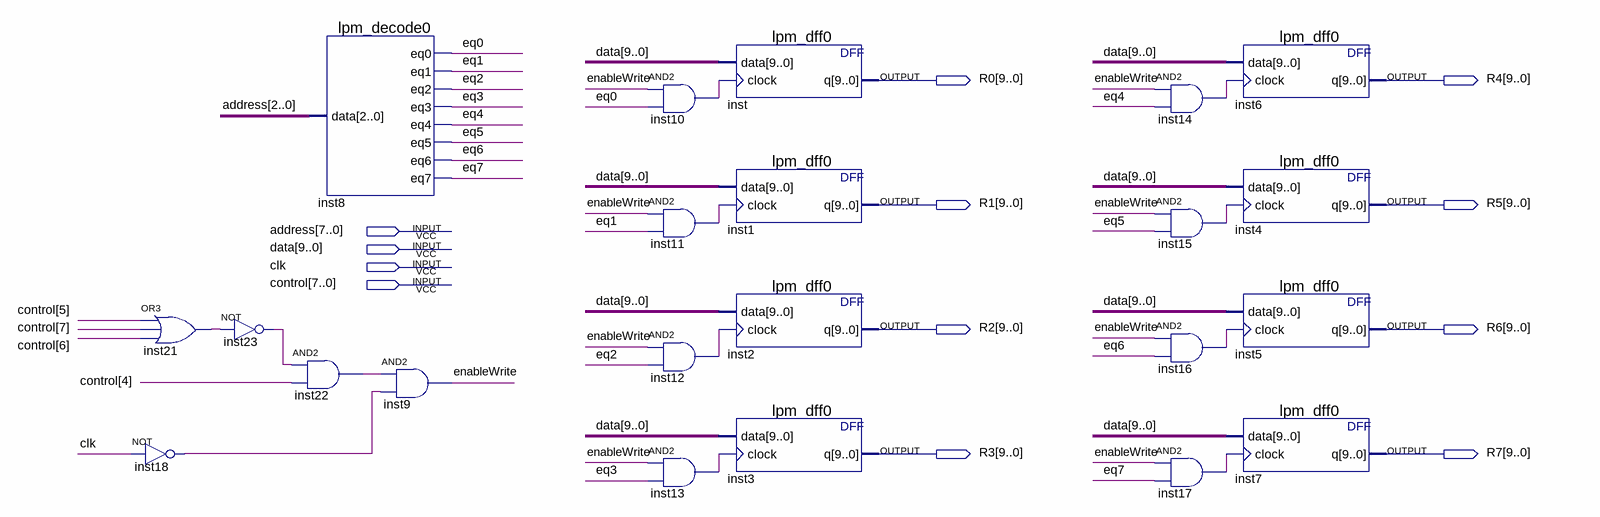
[diagram p0: schematic sheet]
// Quartus schematic POH.bdf as structural Verilog: 22 symbols, 12 pins
module POH (
  input  [7:0] address,
  input  [9:0] data,
  input  clk,
  input  [7:0] control,
  output [9:0] R0,
  output [9:0] R4,
  output [9:0] R1,
  output [9:0] R5,
  output [9:0] R2,
  output [9:0] R6,
  output [9:0] R3,
  output [9:0] R7
);

  wire enableWrite, eq0, eq1, eq2, eq3, eq4, eq5, eq6, eq7, inst10_out, inst11_out, inst12_out, inst13_out,
       inst14_out, inst15_out, inst16_out, inst17_out, inst18_out, inst21_out, inst22_out, inst23_out;

  not inst18 (inst18_out, clk);
  or inst21 (inst21_out, control[5], control[7], control[6]);
  not inst23 (inst23_out, inst21_out);
  lpm_decode0 inst8 (
    .data(address[2:0]), .eq0(eq0), .eq1(eq1), .eq2(eq2), .eq3(eq3), .eq4(eq4), .eq5(eq5), .eq6(eq6),
    .eq7(eq7));
  and inst22 (inst22_out, inst23_out, control[4]);
  and inst9 (enableWrite, inst22_out, inst18_out);
  and inst10 (inst10_out, enableWrite, eq0);
  and inst11 (inst11_out, enableWrite, eq1);
  and inst12 (inst12_out, enableWrite, eq2);
  and inst13 (inst13_out, enableWrite, eq3);
  lpm_dff0 inst (.data(data), .clock(inst10_out), .q(R0));
  lpm_dff0 inst1 (.data(data), .clock(inst11_out), .q(R1));
  lpm_dff0 inst2 (.data(data), .clock(inst12_out), .q(R2));
  lpm_dff0 inst3 (.data(data), .clock(inst13_out), .q(R3));
  and inst14 (inst14_out, enableWrite, eq4);
  and inst15 (inst15_out, enableWrite, eq5);
  and inst16 (inst16_out, enableWrite, eq6);
  and inst17 (inst17_out, enableWrite, eq7);
  lpm_dff0 inst6 (.data(data), .clock(inst14_out), .q(R4));
  lpm_dff0 inst4 (.data(data), .clock(inst15_out), .q(R5));
  lpm_dff0 inst5 (.data(data), .clock(inst16_out), .q(R6));
  lpm_dff0 inst7 (.data(data), .clock(inst17_out), .q(R7));
endmodule
